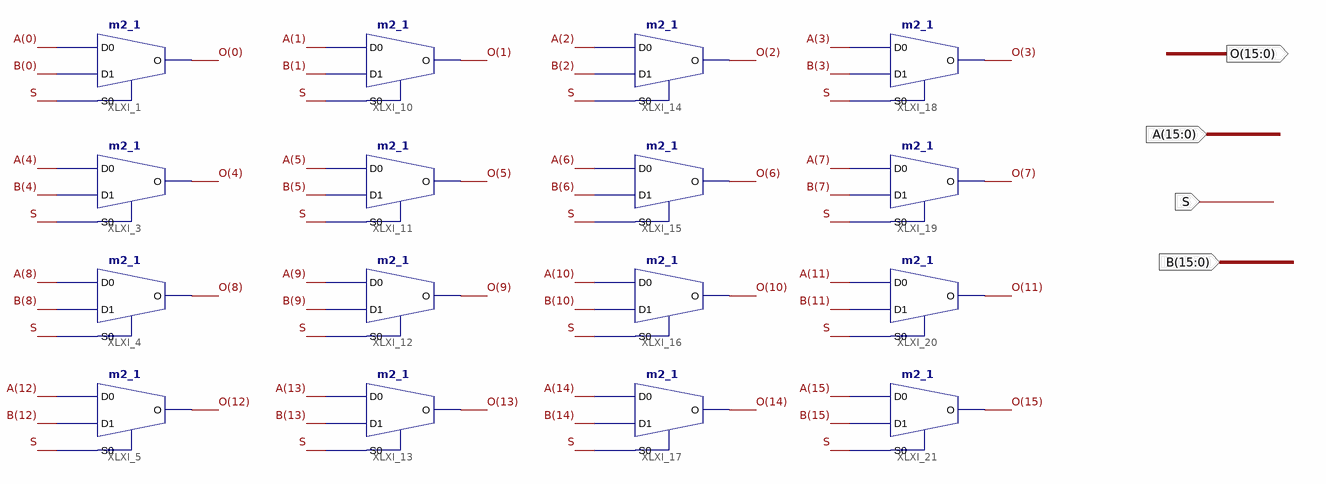
[diagram p0: schematic sheet 1]
// Xilinx ISE schematic mux2input16bit.sch (spartan3adsp) as structural Verilog: 16 symbols, 4 ports
module mux2input16bit (
  input  S,
  input  [15:0] A,
  input  [15:0] B,
  output [15:0] O
);

  m2_1 XLXI_1 (.D0(A[0]), .D1(B[0]), .S0(S), .O(O[0]));
  m2_1 XLXI_3 (.D0(A[4]), .D1(B[4]), .S0(S), .O(O[4]));
  m2_1 XLXI_4 (.D0(A[8]), .D1(B[8]), .S0(S), .O(O[8]));
  m2_1 XLXI_5 (.D0(A[12]), .D1(B[12]), .S0(S), .O(O[12]));
  m2_1 XLXI_10 (.D0(A[1]), .D1(B[1]), .S0(S), .O(O[1]));
  m2_1 XLXI_11 (.D0(A[5]), .D1(B[5]), .S0(S), .O(O[5]));
  m2_1 XLXI_12 (.D0(A[9]), .D1(B[9]), .S0(S), .O(O[9]));
  m2_1 XLXI_13 (.D0(A[13]), .D1(B[13]), .S0(S), .O(O[13]));
  m2_1 XLXI_14 (.D0(A[2]), .D1(B[2]), .S0(S), .O(O[2]));
  m2_1 XLXI_15 (.D0(A[6]), .D1(B[6]), .S0(S), .O(O[6]));
  m2_1 XLXI_16 (.D0(A[10]), .D1(B[10]), .S0(S), .O(O[10]));
  m2_1 XLXI_17 (.D0(A[14]), .D1(B[14]), .S0(S), .O(O[14]));
  m2_1 XLXI_18 (.D0(A[3]), .D1(B[3]), .S0(S), .O(O[3]));
  m2_1 XLXI_19 (.D0(A[7]), .D1(B[7]), .S0(S), .O(O[7]));
  m2_1 XLXI_20 (.D0(A[11]), .D1(B[11]), .S0(S), .O(O[11]));
  m2_1 XLXI_21 (.D0(A[15]), .D1(B[15]), .S0(S), .O(O[15]));
endmodule
